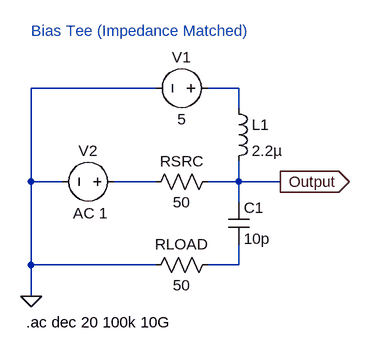
[diagram p0: schematic Bias-Tee_v1_AC_matched.asc]
Bias-Tee_v1_AC_matched.asc, the LTspice schematic file:
Version 4
SHEET 1 880 680
WIRE 96 0 -96 0
WIRE 224 0 176 0
WIRE 224 32 224 0
WIRE -96 144 -96 0
WIRE -48 144 -96 144
WIRE 96 144 32 144
WIRE 224 144 224 112
WIRE 224 144 176 144
WIRE 288 144 224 144
WIRE 224 176 224 144
WIRE -96 272 -96 144
WIRE 96 272 -96 272
WIRE 224 272 224 240
WIRE 224 272 176 272
WIRE -96 320 -96 272
FLAG 288 144 Output
IOPIN 288 144 Out
FLAG -96 320 0
SYMBOL voltage 192 0 R90
WINDOW 0 -32 56 VBottom 2
WINDOW 3 32 56 VTop 2
WINDOW 123 0 0 Left 0
WINDOW 39 0 0 Left 0
SYMATTR InstName V1
SYMATTR Value 5
SYMBOL voltage 48 144 R90
WINDOW 0 -32 56 VBottom 2
WINDOW 3 32 56 VTop 2
WINDOW 123 33 53 VTop 2
WINDOW 39 0 0 Left 0
SYMATTR InstName V2
SYMATTR Value ""
SYMATTR Value2 AC 1
SYMBOL ind 208 16 R0
SYMATTR InstName L1
SYMATTR Value 2.2µ
SYMBOL res 192 128 R90
WINDOW 0 0 56 VBottom 2
WINDOW 3 32 56 VTop 2
SYMATTR InstName RSRC
SYMATTR Value 50
SYMBOL cap 208 176 R0
SYMATTR InstName C1
SYMATTR Value 10p
SYMBOL res 192 256 R90
WINDOW 0 0 56 VBottom 2
WINDOW 3 32 56 VTop 2
SYMATTR InstName RLOAD
SYMATTR Value 50
TEXT -96 -88 Left 2 ;Bias Tee (Impedance Matched)
TEXT -104 360 Left 2 !.ac dec 20 100k 10G

The netlist it stands for:
* Bias-Tee_v1_AC_matched.asc
V1 N001 0 5
V2 N002 0 AC 1
L1 N001 Output 2.2µ
RSRC Output N002 50
C1 Output N003 10p
RLOAD N003 0 50
* Bias Tee (Impedance Matched)
.ac dec 20 100k 10G
.backanno
.end